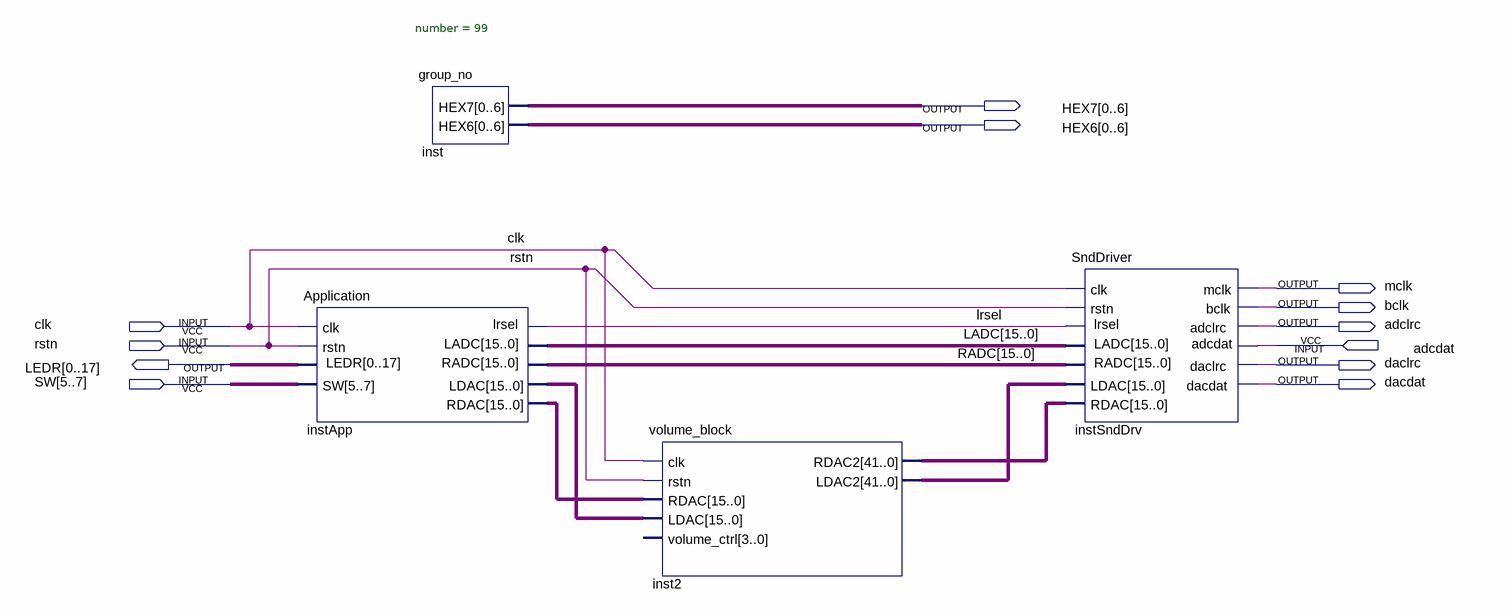
[diagram p0: schematic sheet]
// Quartus schematic Sound.bdf as structural Verilog: 4 symbols, 12 pins
module Sound (
  input  clk,
  input  rstn,
  input  adcdat,
  input  [5:7] SW,
  output [0:6] HEX7,
  output [0:6] HEX6,
  output mclk,
  output bclk,
  output adclrc,
  output [0:17] LEDR,
  output daclrc,
  output dacdat
);

  wire lrsel;
  wire [15:0] instApp_ldac, instApp_rdac, LADC, RADC;
  wire [41:0] inst2_ldac2, inst2_rdac2;

  Application instApp (
    .clk(clk), .rstn(rstn), .SW(SW), .lrsel(lrsel), .LADC(LADC), .RADC(RADC), .LEDR(LEDR),
    .LDAC(instApp_ldac), .RDAC(instApp_rdac));
  group_no #(.number(99)) inst (.HEX7(HEX7), .HEX6(HEX6));
  volume_block inst2 (
    .clk(clk), .rstn(rstn), .RDAC(instApp_rdac), .LDAC(instApp_ldac), .RDAC2(inst2_rdac2), .LDAC2(inst2_ldac2));  // open: volume_ctrl
  SndDriver instSndDrv (
    .clk(clk), .rstn(rstn), .LDAC(inst2_ldac2), .adcdat(adcdat), .RDAC(inst2_rdac2), .mclk(mclk),
    .bclk(bclk), .adclrc(adclrc), .daclrc(daclrc), .lrsel(lrsel), .LADC(LADC), .dacdat(dacdat), .RADC(RADC));
endmodule
